# EAGLE design oven-controller-v3 (EAGLE 6.4)
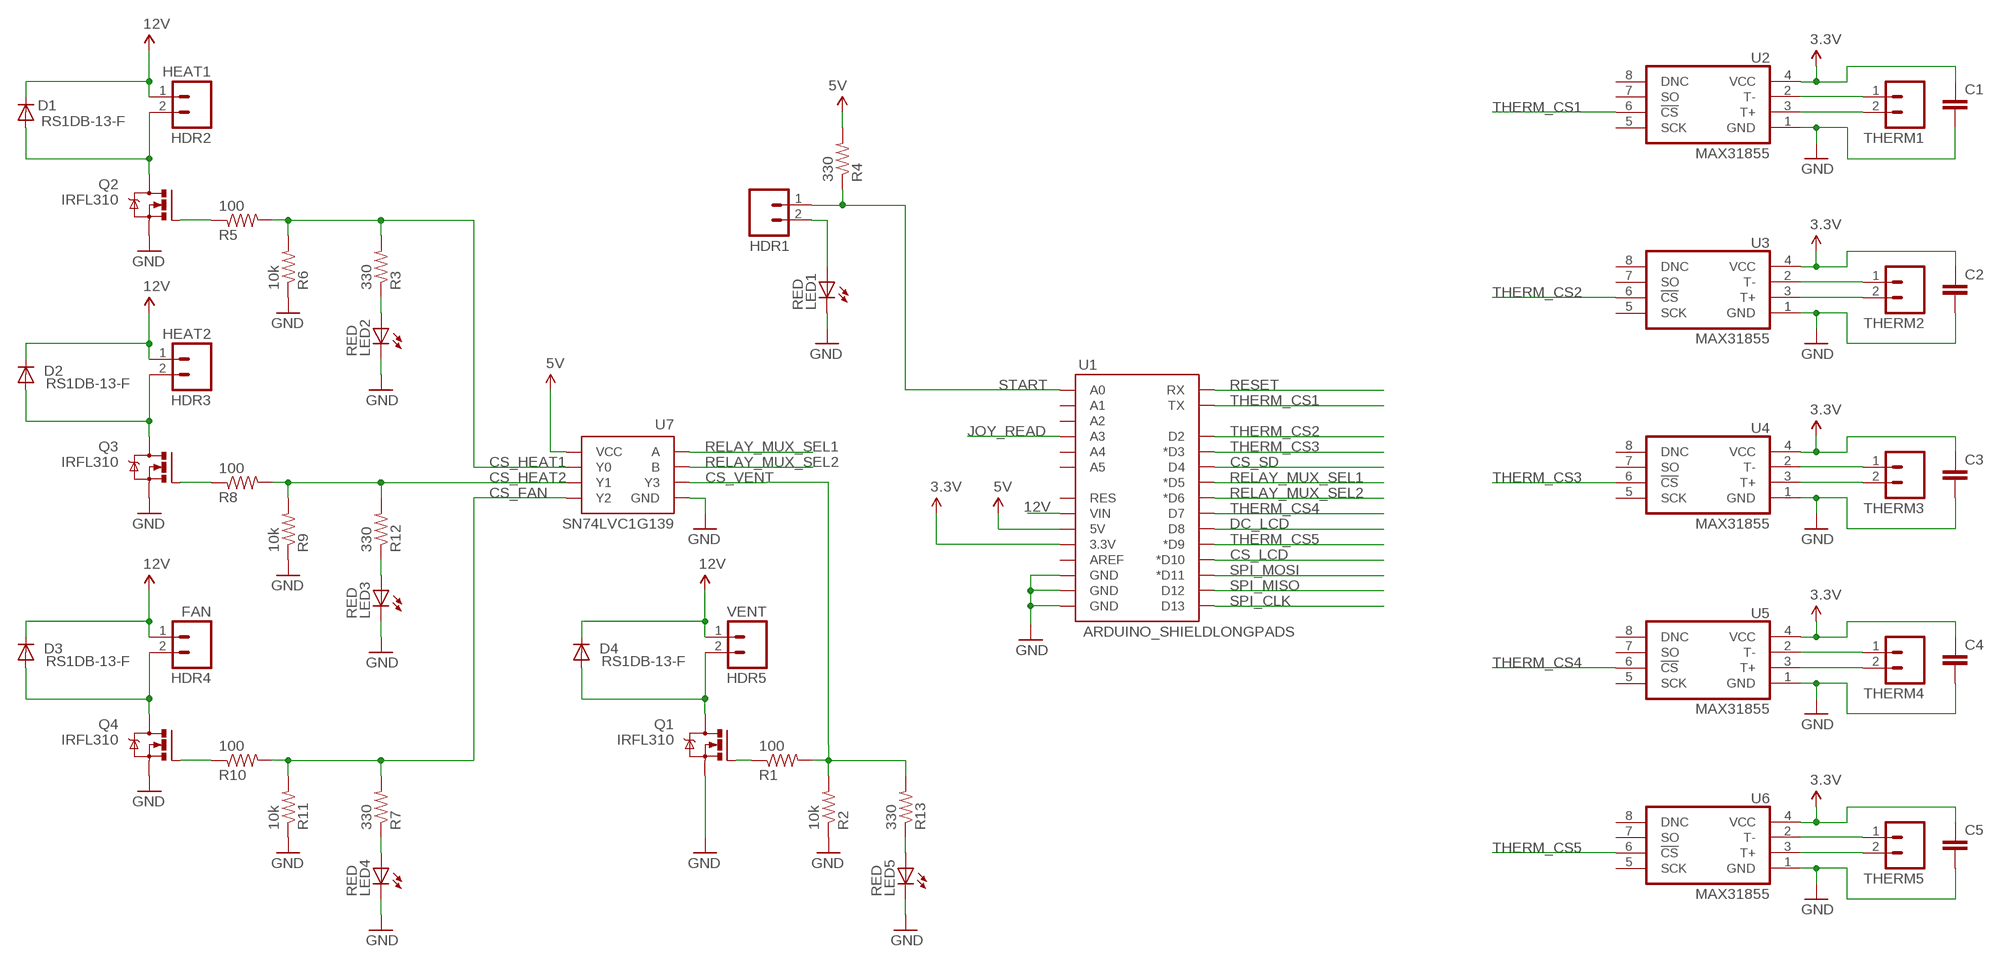
[diagram p0: schematic, sheet 1]

## Parts
C1  C-EUC0603K  [C0603K]
C2  C-EUC0603K  [C0603K]
C3  C-EUC0603K  [C0603K]
C4  C-EUC0603K  [C0603K]
C5  C-EUC0603K  [C0603K]
D1  RS1DB-13-F  DIODESMA-ALT  [SMA-DIODE_ALT]
D2  RS1DB-13-F  DIODESMA-ALT  [SMA-DIODE_ALT]
D3  RS1DB-13-F  DIODESMA-ALT  [SMA-DIODE_ALT]
D4  RS1DB-13-F  DIODESMA-ALT  [SMA-DIODE_ALT]
HDR1  M023.5MM_LOCK  [SCREWTERMINAL-3.5MM-2_LOCK]
HDR2  HEAT1  M023.5MM_LOCK  [SCREWTERMINAL-3.5MM-2_LOCK]
HDR3  HEAT2  M023.5MM_LOCK  [SCREWTERMINAL-3.5MM-2_LOCK]
HDR4  FAN  M023.5MM_LOCK  [SCREWTERMINAL-3.5MM-2_LOCK]
HDR5  VENT  M023.5MM_LOCK  [SCREWTERMINAL-3.5MM-2_LOCK]
LED1  RED  LED0603  [LED-0603]
LED2  RED  LED0603  [LED-0603]
LED3  RED  LED0603  [LED-0603]
LED4  RED  LED0603  [LED-0603]
LED5  RED  LED0603  [LED-0603]
Q1  IRFL310  IRF520  [TO220BV]
Q2  IRFL310  IRF520  [TO220BV]
Q3  IRFL310  IRF520  [TO220BV]
Q4  IRFL310  IRF520  [TO220BV]
R1  100  R-US_0603-C-NOSILK  [0603-C-NOSILK]
R2  10k  R-US_0603-C-NOSILK  [0603-C-NOSILK]
R3  330  R-US_0603-C-NOSILK  [0603-C-NOSILK]
R4  330  R-US_0603-C-NOSILK  [0603-C-NOSILK]
R5  100  R-US_0603-C-NOSILK  [0603-C-NOSILK]
R6  10k  R-US_0603-C-NOSILK  [0603-C-NOSILK]
R7  330  R-US_0603-C-NOSILK  [0603-C-NOSILK]
R8  100  R-US_0603-C-NOSILK  [0603-C-NOSILK]
R9  10k  R-US_0603-C-NOSILK  [0603-C-NOSILK]
R10  100  R-US_0603-C-NOSILK  [0603-C-NOSILK]
R11  10k  R-US_0603-C-NOSILK  [0603-C-NOSILK]
R12  330  R-US_0603-C-NOSILK  [0603-C-NOSILK]
R13  330  R-US_0603-C-NOSILK  [0603-C-NOSILK]
THERM1  M023.5MM_LOCK  [SCREWTERMINAL-3.5MM-2_LOCK]
THERM2  M023.5MM_LOCK  [SCREWTERMINAL-3.5MM-2_LOCK]
THERM3  M023.5MM_LOCK  [SCREWTERMINAL-3.5MM-2_LOCK]
THERM4  M023.5MM_LOCK  [SCREWTERMINAL-3.5MM-2_LOCK]
THERM5  M023.5MM_LOCK  [SCREWTERMINAL-3.5MM-2_LOCK]
U1  ARDUINO_SHIELDLONGPADS  [DUEMILANOVE_SHIELD_LONGPADS]
U2  MAX31855  IC_MAX31855-SO-8  [SO-8]
U3  MAX31855  IC_MAX31855-SO-8  [SO-8]
U4  MAX31855  IC_MAX31855-SO-8  [SO-8]
U5  MAX31855  IC_MAX31855-SO-8  [SO-8]
U6  MAX31855  IC_MAX31855-SO-8  [SO-8]
U7  SN74LVC1G139  [8LSSOP]

## Nets
3.3V: C1.1 C2.1 C3.1 C4.1 C5.1 U1.3.3V U2.4(VCC) U3.4(VCC) U4.4(VCC) U5.4(VCC) U6.4(VCC)
5V: R4.2 U1.5V U7.P$8(VCC)
12V: D1.C D2.C D3.C D4.C HDR2.1 HDR3.1 HDR4.1 HDR5.1 U1.VIN
CS_FAN: R7.2 R10.2 R11.2 U7.P$5(Y2)
CS_HEAT1: R3.2 R5.2 R6.2 U7.P$7(Y0)
CS_HEAT2: R8.2 R9.2 R12.2 U7.P$6(Y1)
CS_LCD: U1.D10(*D10)
CS_SD: U1.D4
CS_VENT: R1.2 R2.2 R13.2 U7.P$3(Y3)
DC_LCD: U1.D8
GND: C1.2 C2.2 C3.2 C4.2 C5.2 LED1.C LED2.C LED3.C LED4.C LED5.C Q1.S Q2.S Q3.S Q4.S R2.1 R6.1 R9.1 R11.1 U1.GND@0(GND) U1.GND@1(GND) U1.GND@2(GND) U2.1(GND) U3.1(GND) U4.1(GND) U5.1(GND) U6.1(GND) U7.P$4(GND)
HDR3: D3.A HDR4.2 Q4.D
JOY_READ: U1.A3
N$1: Q2.G R5.1
N$2: Q1.G R1.1
N$3: D4.A HDR5.2 Q1.D
N$4: D1.A HDR2.2 Q2.D
N$5: THERM1.1 U2.2(T-)
N$6: THERM1.2 U2.3(T+)
N$7: LED2.A R3.1
N$8: THERM2.1 U3.2(T-)
N$9: LED4.A R7.1
N$10: HDR1.2 LED1.A
N$11: THERM2.2 U3.3(T+)
N$12: THERM3.1 U4.2(T-)
N$13: THERM3.2 U4.3(T+)
N$14: THERM4.1 U5.2(T-)
N$15: THERM4.2 U5.3(T+)
N$16: THERM5.1 U6.2(T-)
N$17: THERM5.2 U6.3(T+)
N$18: LED3.A R12.1
N$19: LED5.A R13.1
N$20: Q3.G R8.1
N$21: D2.A HDR3.2 Q3.D
N$23: Q4.G R10.1
RELAY_MUX_SEL1: U1.D5(*D5) U7.P$1(A)
RELAY_MUX_SEL2: U1.D6(*D6) U7.P$2(B)
RESET: U1.RX
SPI_CLK: U1.D13
SPI_MISO: U1.D12
SPI_MOSI: U1.D11(*D11)
START: HDR1.1 R4.1 U1.A0
THERM_CS1: U1.TX U2.6(!CS)
THERM_CS2: U1.D2 U3.6(!CS)
THERM_CS3: U1.D3(*D3) U4.6(!CS)
THERM_CS4: U1.D7 U5.6(!CS)
THERM_CS5: U1.D9(*D9) U6.6(!CS)
Unconnected: U1.A1 U1.A2 U1.A4 U1.A5 U1.AREF U1.RES U2.5(SCK) U2.7(SO) U2.8(DNC) U3.5(SCK) U3.7(SO) U3.8(DNC) U4.5(SCK) U4.7(SO) U4.8(DNC) U5.5(SCK) U5.7(SO) U5.8(DNC) U6.5(SCK) U6.7(SO) U6.8(DNC)

## Library data of the parts
C1-C5 = rcl_custom:C-EU: CAPACITOR, European symbol
D1-D4 = SparkFun-DiscreteSemi:DIODE: Diode These are standard reverse protection diodes and small signal diodes. SMA package can handle up to about 1A. SOD-323 can handle about 200mA. What the SOD-323 package when ordering, there are some mfgs out there that are 5-pin packages.
HDR1-HDR5 THERM1-THERM5 = SparkFun-Connectors:M02: Header 2 Standard 2-pin 0.1" header. Use with straight break away headers (SKU : PRT-00116), right angle break away headers (PRT-00553), swiss pins (PRT-00743), machine pins (PRT-00117), and female headers (PRT-00115). Molex polarized connector foot print use with SKU : PRT-08233 with associated crimp pins and housings.
LED1-LED5 = SparkFun-LED:LED: LEDs Standard schematic elements and footprints for 5mm, 3mm, 1206, and 0603 sized LEDs. 5mm - Spark Fun Electronics SKU : COM-00529 (and others)
Q1-Q4 = transistor-power:IRF520: HEXFET Power MOSFET
R1-R13 = rcl_custom:R-US_: RESISTOR, American symbol
U1 = SparkFun-Boards:ARDUINO_SHIELD: Arduino shield footprint
U2-U6 = dp_devices:IC_MAX31855
U7 = wicker:SN74LVC1G139

## Board
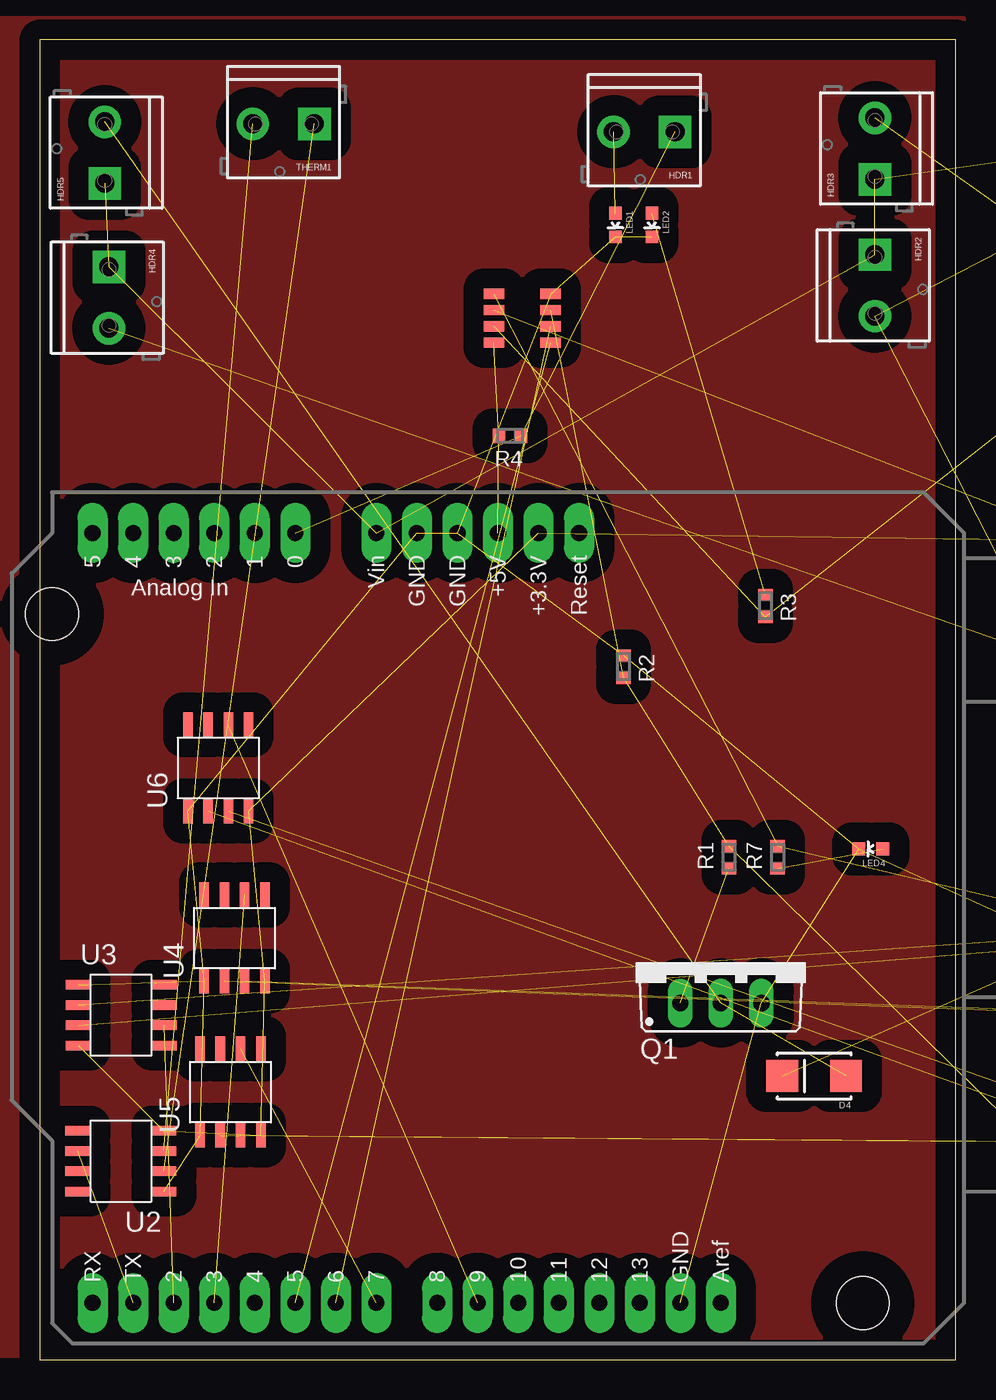
[diagram p1: board, top side]

Size 57.38 x 82.73 mm. Coordinates in mm from the lower left corner, seen from the top.
Outline: 0,0 57.38,0 57.38,82.73 0,82.73 0,0
Copper layers (1*16): Top 0.0178mm / dielectric 59mil / Bottom 0.0178mm
Design rules "epl-lpkf": minimum track width 8mil, minimum drill 0.35mm, track to track 8mil, track to pad 8mil, pad to pad 8mil, via to via 8mil, smd to smd 8mil, copper to edge 15mil, drill to drill 15mil, minimum pad ring 8mil, minimum via ring 8mil, stop-mask expansion 3mil, vias tented up to drill 0mil, thermal gap 10mil

### Footprints (pad centres in the part's own frame; a part is rotated, then mirrored left to right if it is on the bottom)
C0603K = smd 1.05 x 1.08: 1 -0.875,0; 2 0.875,0
SMA-DIODE_ALT = smd 2 x 2: A -2,0; C 2,0
SCREWTERMINAL-3.5MM-2_LOCK = drill 1.2 pad 2.032 square: 1 -0.178,0 | drill 1.2 pad 2.032: 2 3.678,0
LED-0603 = smd 0.8 x 0.8: A 0,-0.75; C 0,0.75
TO220BV = drill 1.016 long: D 0,-2.54; G -2.54,-2.54; S 2.54,-2.54
0603-C-NOSILK = smd 0.75 x 0.9: 1 -0.7,0; 2 0.7,0
DUEMILANOVE_SHIELD_LONGPADS = drill 1.016 pad 1.88 long: 3.3V 50.8,26.67; 5V 50.8,29.21; A0 50.8,41.91; A1 50.8,44.45; A2 50.8,46.99; A3 50.8,49.53; A4 50.8,52.07; A5 50.8,54.61; AREF 2.54,15.24; D2 2.54,49.53; D3 2.54,46.99; D4 2.54,44.45; D5 2.54,41.91; D6 2.54,39.37; D7 2.54,36.83; D8 2.54,33.02; D9 2.54,30.48; D10 2.54,27.94; D11 2.54,25.4; D12 2.54,22.86; D13 2.54,20.32; GND@0 50.8,31.75; GND@1 50.8,34.29; GND@2 2.54,17.78; RES 50.8,24.13; RX 2.54,54.61; TX 2.54,52.07; VIN 50.8,36.83 | hole 3.302: 45.72,57.15; 2.54,6.35
SO-8 = smd 0.6 x 1.55: 1 -1.905,-2.69; 2 -0.635,-2.69; 3 0.635,-2.69; 4 1.905,-2.69; 5 1.905,2.71; 6 0.635,2.71; 7 -0.635,2.71; 8 -1.905,2.71
8LSSOP = smd 1.27 x 0.635: P$1 -1.778,2.794; P$2 -1.778,1.778; P$3 -1.778,0.762; P$4 -1.778,-0.254; P$5 1.778,-0.254; P$6 1.778,0.762; P$7 1.778,1.778; P$8 1.778,2.794

### Placement (x,y rotation side)
C1  87.38,57.66 0 top  (outside the outline)
C2  87.38,54.36 0 top  (outside the outline)
C3  87.38,51.05 0 top  (outside the outline)
C4  87.38,47.75 0 top  (outside the outline)
C5  87.38,44.45 0 top  (outside the outline)
D1  78.49,77.98 0 top  (outside the outline)
D2  78.49,55.37 0 top  (outside the outline)
D3  78.49,32.77 0 top  (outside the outline)
D4  48.51,17.78 180 top
HDR1  39.62,76.96 180 top
HDR2  52.32,69.09 270 top
HDR3  52.32,74.17 90 top
HDR4  4.32,68.33 270 top
HDR5  4.06,73.91 90 top
LED1  36.07,71.12 180 top
LED2  38.35,71.12 180 top
LED3  70.61,18.29 0 top  (outside the outline)
LED4  52.07,32 90 top
LED5  70.61,8.38 0 top  (outside the outline)
Q1  42.67,24.89 0 top
Q2  79.25,7.87 90 top  (outside the outline)
Q3  72.9,65.79 0 top  (outside the outline)
Q4  72.9,43.18 0 top  (outside the outline)
R1  43.18,31.5 90 top
R2  36.58,43.43 270 top
R3  45.47,47.24 270 top
R4  29.46,57.91 180 top
R5  72.14,71.12 0 top  (outside the outline)
R6  72.14,68.07 0 top  (outside the outline)
R7  46.23,31.5 90 top
R8  72.14,48.51 0 top  (outside the outline)
R9  72.14,45.47 0 top  (outside the outline)
R10  72.14,25.91 0 top  (outside the outline)
R11  72.14,22.86 0 top  (outside the outline)
R12  72.14,12.95 0 top  (outside the outline)
R13  72.14,3.05 0 top  (outside the outline)
THERM1  17.02,77.47 180 top
THERM2  88.39,28.19 0 top  (outside the outline)
THERM3  88.39,20.83 0 top  (outside the outline)
THERM4  88.39,13.46 0 top  (outside the outline)
THERM5  88.39,6.1 0 top  (outside the outline)
U1  57.91,1.02 90 top
U2  5.08,12.45 90 top
U3  5.08,21.59 270 top
U4  12.19,26.42 0 top
U5  11.94,16.76 0 top
U6  11.18,37.08 0 top
U7  30.23,66.55 180 top

### Tracks (layer width: path | path; a pad name or v marks a point on that pad's centre or on a via)
3.3V  (10 unrouted)
5V  (2 unrouted)
12V  (8 unrouted)
CS_FAN  (3 unrouted)
CS_HEAT1  (3 unrouted)
CS_HEAT2  (3 unrouted)
CS_VENT  (3 unrouted)
GND  (26 unrouted)
HDR3  (2 unrouted)
N$1  (1 unrouted)
N$2  (1 unrouted)
N$3  (2 unrouted)
N$4  (2 unrouted)
N$5  (1 unrouted)
N$6  (1 unrouted)
N$7  (1 unrouted)
N$8  (1 unrouted)
N$9  (1 unrouted)
N$10  (1 unrouted)
N$11  (1 unrouted)
N$12  (1 unrouted)
N$13  (1 unrouted)
N$14  (1 unrouted)
N$15  (1 unrouted)
N$16  (1 unrouted)
N$17  (1 unrouted)
N$18  (1 unrouted)
N$19  (1 unrouted)
N$20  (1 unrouted)
N$21  (2 unrouted)
N$22
  pour Top (isolate 1.27): -4.83,84.07 -4.83,0.25 57.91,0.25 57.91,84.07
N$23  (1 unrouted)
RELAY_MUX_SEL1  (1 unrouted)
RELAY_MUX_SEL2  (1 unrouted)
START  (2 unrouted)
THERM_CS1  (1 unrouted)
THERM_CS2  (1 unrouted)
THERM_CS3  (1 unrouted)
THERM_CS4  (1 unrouted)
THERM_CS5  (1 unrouted)